# EAGLE design Variable_PWM (EAGLE 9.6.2)
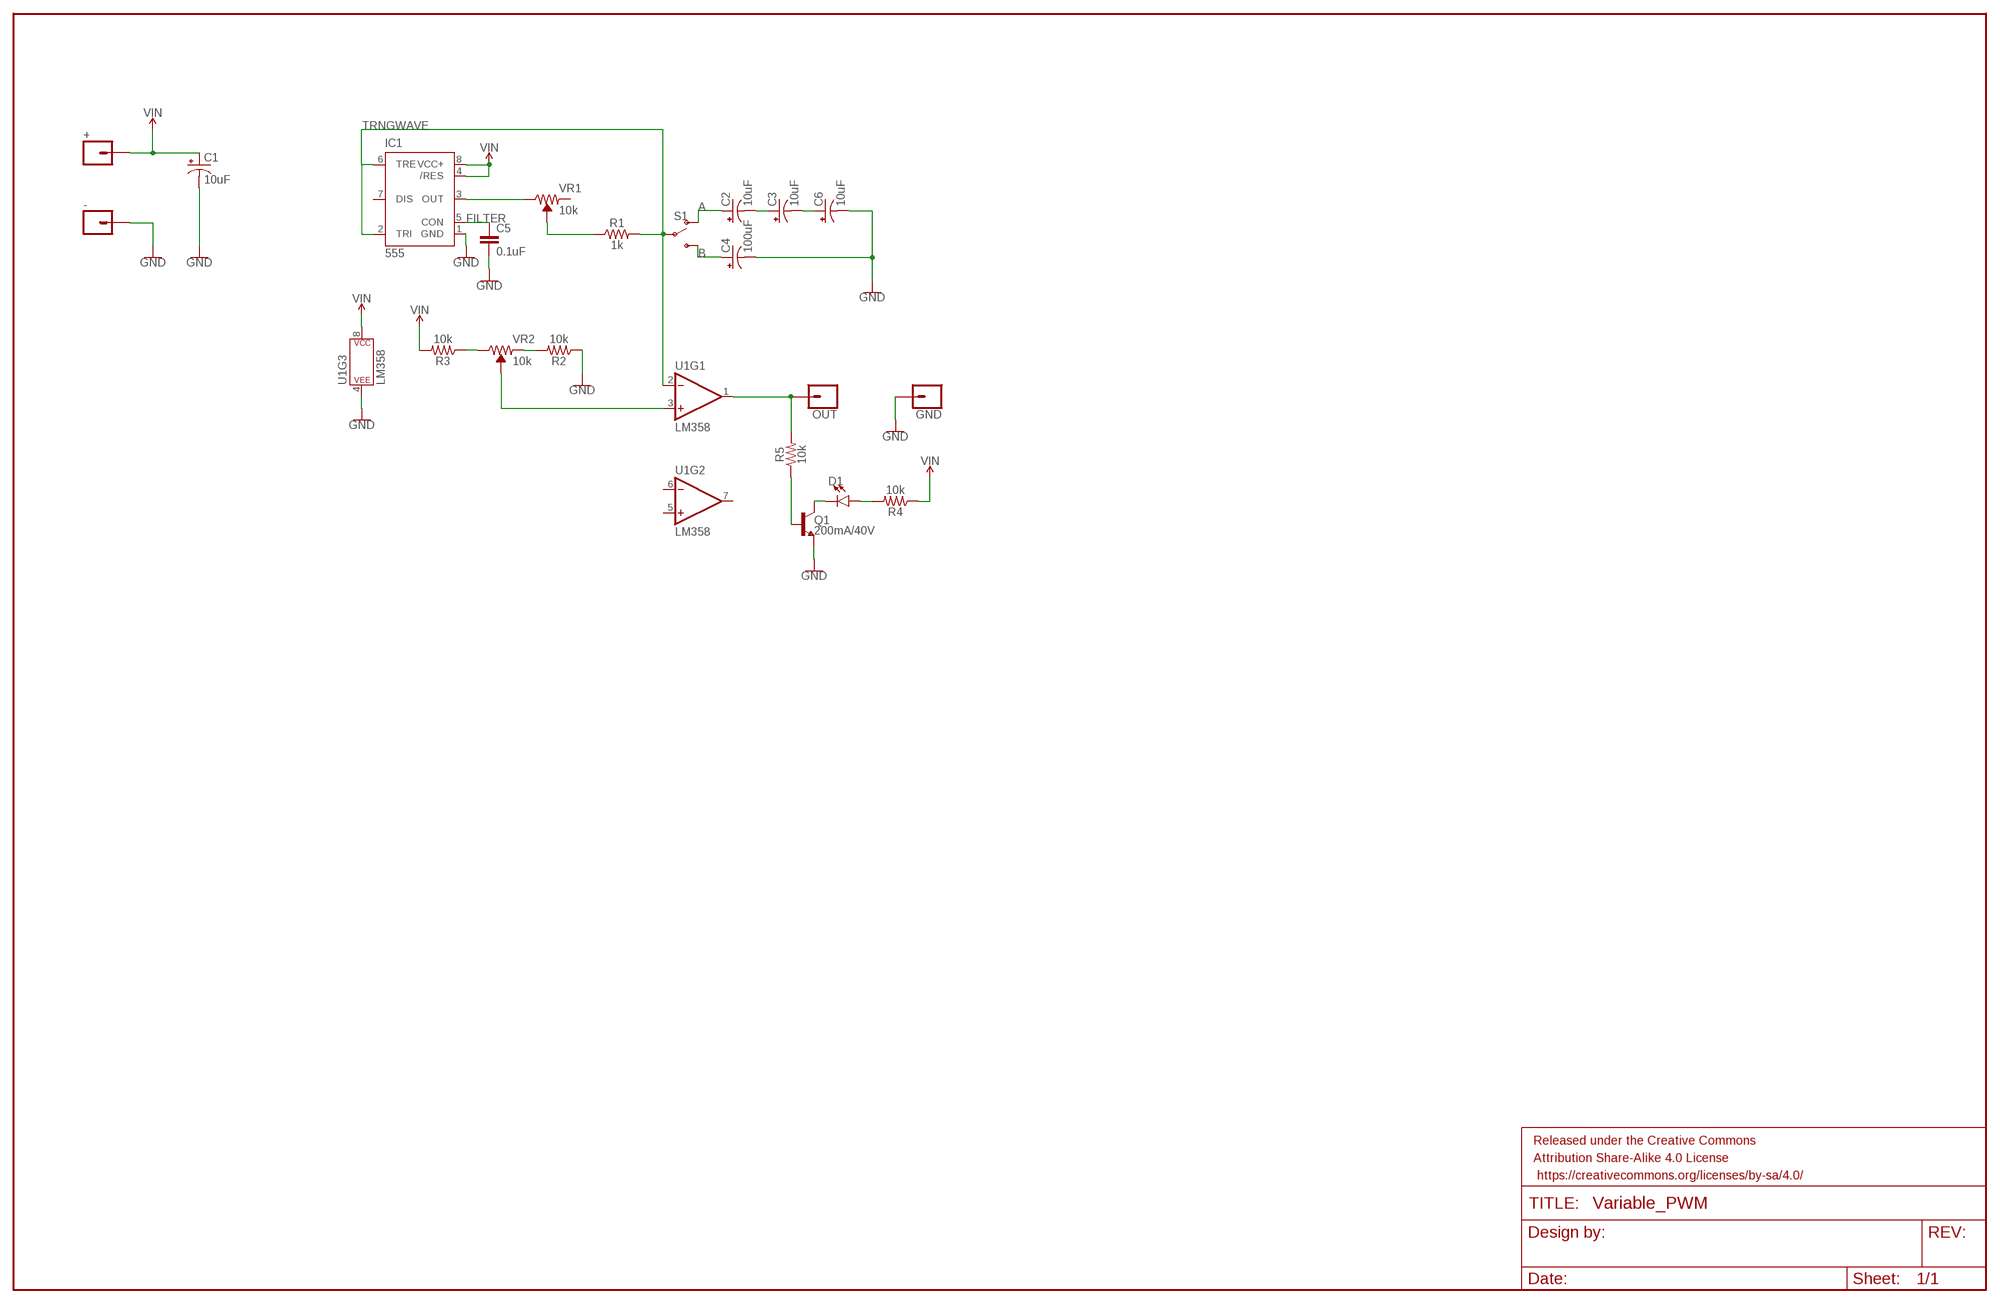
[diagram p0: schematic, sheet 1]

## Parts
+  CONN_01  [1X01]
-  CONN_01  [1X01]
C1  10uF  10UF-POLAR-RADIAL-2.5MM-25V-20%  [CPOL-RADIAL-2.5MM-5MM]
C2  10uF  10UF-POLAR-RADIAL-2.5MM-25V-20%  [CPOL-RADIAL-2.5MM-5MM]
C3  10uF  10UF-POLAR-RADIAL-2.5MM-25V-20%  [CPOL-RADIAL-2.5MM-5MM]
C4  100uF  100UF-POLAR-RADIAL-2.5MM-25V-20%  [CPOL-RADIAL-2.5MM-6.5MM]
C5  0.1uF  0.1UF-KIT-EZ-50V-20%  [CAP-PTH-SMALL-KIT]
C6  10uF  10UF-POLAR-RADIAL-2.5MM-25V-20%  [CPOL-RADIAL-2.5MM-5MM]
D1  LED5MM  [LED_5MM]
FRAME1  FRAME-LEDGERNO_FOOTPRINT  [DUMMY]
GND  CONN_01  [1X01]
IC1  555  555P  [DIP08]
OUT  CONN_01  [1X01]
Q1  200mA/40V  TRANS_NPN-2N3904  [TO-92]
R1  1k  1KOHM-HORIZ-1/4W-1%  [AXIAL-0.3]
R2  10k  10KOHM-HORIZ-1/4W-1%  [AXIAL-0.3]
R3  10k  10KOHM-HORIZ-1/4W-1%  [AXIAL-0.3]
R4  10k  10KOHM-HORIZ-1/4W-1%  [AXIAL-0.3]
R5  10k  10KOHM-HORIZ-1/4W-1%  [AXIAL-0.3]
S1  SWITCH-SPDT-PTH-11.6X4.0MM  [SWITCH_SPDT_PTH_11.6X4.0MM]
U1  LM358  [DIP08]
VR1  10k  TRIMPOT-PTH-10MM-KNOB-1/2W-10%  [TRIMPOT-PTH-3386U]
VR2  10k  TRIMPOT-PTH-10MM-KNOB-1/2W-10%  [TRIMPOT-PTH-3386U]

## Nets
A: C2.1(+) S1.1(O)
B: C4.1(+) S1.3(S)
FILTER: C5.1 IC1.5(CON)
GND: -.1 C1.2(-) C4.2(-) C5.2 C6.2(-) GND.1 IC1.1(GND) Q1.1(E) R2.P$1 U1.4(P$V-)
N$1: C2.2(-) C3.1(+)
N$2: C3.2(-) C6.1(+)
N$3: R1.P$1 VR1.2(WIPER)
N$4: IC1.3(OUT) VR1.3(CW)
N$8: R2.P$2 VR2.1(CCW)
N$9: R3.P$1 VR2.3(CW)
N$10: U1.3(+IN) VR2.2(WIPER)
N$12: D1.A R4.P$2
N$13: D1.K(C) Q1.3(C)
N$14: Q1.2(B) R5.P$1
OUT: OUT.1 R5.P$2 U1.1(OUT)
TRNGWAVE: IC1.2(TRI) IC1.6(TRE) R1.P$2 S1.2(P) U1.2(-IN)
VIN: +.1 C1.1(+) IC1.4(/RES) IC1.8(VCC+) R3.P$2 R4.P$1 U1.8(P$V+)
Unconnected: IC1.7(DIS) U1.5(+IN) U1.6(-IN) U1.7(OUT) VR1.1(CCW)

## Library data of the parts
+ - GND OUT = SparkFun-Connectors:CONN_01: Single connection point. Often used as Generic Header-pin footprint for 0.1 inch spaced/style header connections On any of the 0.1 inch spaced packages, you can populate with these: Break Away Headers - Straight <https://www.sparkfun.com/products/116> (PRT-00116) Break Away Male Headers - Right Angle <https://www.sparkfun.com/products/553> (PRT-00553) Female Headers <https://www.sparkfun.com/products/115> (PRT-00115) Break Away Headers - Machine Pin <https://www.sparkfun.com/products/117> (PRT-00117) Break Away Female Headers - Swiss Machine Pin <https://www.sparkfun.com/products/743> (PRT-00743) This device is also useful as a general connection point to wire up your design to another part of your project. Our various solder wires solder well into these plated through hole pads. Hook-Up Wire - Assortment (Stranded, 22 AWG) <https://www.sparkfun.com/products/11375> (PRT-11375) Hook-Up Wire - Assortment (Solid Core, 22 AWG) <https://www.sparkfun.com/products/11367> (PRT-11367) View the entire wire category on our website here <https://www.sparkfun.com/categories/141> Special notes: SMTSO-256-ET is a "flush mount" nut for a 4-40 screw. We mostly use this on specialty testbeds; it is a nice way to connect hardware to your PCB at an adjustable hieght. Also note, the SNAP packages are for using a snappable style connector. We sell a baggie of snaps and they are also used on two LilyPad designs: Snap Assortment - 30 pack (male and female) <https://www.sparkfun.com/products/11347> (DEV-11347) LilyPad Arduino SimpleSnap <https://www.sparkfun.com/products/10941> (DEV-10941) LilyPad SimpleSnap Protoboard <https://www.sparkfun.com/products/10940> (DEV-10940)
C1-C3 C6 = SparkFun-Capacitors:10UF-POLAR: 10.0µF polarized capacitors A capacitor is a passive two-terminal electrical component used to store electrical energy temporarily in an electric field.; PROD_ID: CAP-08440
C4 = SparkFun-Capacitors:100UF-POLAR: 100µF polarized capacitors A capacitor is a passive two-terminal electrical component used to store electrical energy temporarily in an electric field.; PROD_ID: CAP-08439
C5 = SparkFun-Capacitors:0.1UF: 0.1µF ceramic capacitors A capacitor is a passive two-terminal electrical component used to store electrical energy temporarily in an electric field.; PROD_ID: CAP-08370
D1 = SparkFun-LED:LED: LED (Generic) Standard schematic elements and footprints for 5mm, 3mm, 1206, and 0603 sized LEDs. Generic LEDs with no color specified.
FRAME1 = SparkFun-Aesthetics:FRAME-LEDGER: Schematic Frame - Ledger Standard 11x14 US Ledger frame
IC1 = SparkFun-IC-Special-Function:555: General purpose bipolar Timer Datasheet <http://www.sparkfun.com/datasheets/Components/General/ne555.pdf> SparkFun Products SparkFun SparkPunk Sequencer Kit <https://www.sparkfun.com/products/12707> (KIT-12707) Storefront Component: 555 Timer <https://www.sparkfun.com/products/9273> (COM-09273) Two parts valid for production: VFP: IC-11930 (M7555 PTH) VFP: IC-09173 (555 PTH) - Preferred; PROD_ID: IC-09173; PROD_ID_ALT: IC-09173
Q1 = SparkFun-DiscreteSemi:TRANS_NPN: NPN transistor Current controlled devices typically used to amplify current or used as a switch. BC547 - COM-08928 <http://www.sparkfun.com/products/8928> (TO-92 45V 100mA) (1.Collector 2.Base 3.Emitter) 2N3904 - COM-00521 <http://www.sparkfun.com/products/521> (TO-92 40V 200mA) (1.Emitter 2.Base 3.Collector) P2N2222A - COM-12852 <http://www.sparkfun.com/products/12852> (TO-92 40V 600mA) (1.Collector 2.Base 3.Emitter); PROD_ID: TRANS-08447
R1 = SparkFun-Resistors:1KOHM: 1kΩ resistor A resistor is a passive two-terminal electrical component that implements electrical resistance as a circuit element. Resistors act to reduce current flow, and, at the same time, act to lower voltage levels within circuits. - Wikipedia; PROD_ID: RES-12182
R2-R5 = SparkFun-Resistors:10KOHM: 10kΩ resistor A resistor is a passive two-terminal electrical component that implements electrical resistance as a circuit element. Resistors act to reduce current flow, and, at the same time, act to lower voltage levels within circuits. - Wikipedia; PROD_ID: RES-12183
S1 = SparkFun-Switches:SWITCH-SPDT: Single Pole, Double Throw (SPDT) Switch Single-pole, double-throw (SPDT) switch. Variant Overview SMD-AYZ0202 Surface Mount DPDT Switch <https://www.sparkfun.com/products/597> (COM-00597) Used on e.g. LilyPad Arduino USB - ATmega32U4 Board <https://www.sparkfun.com/products/12049> PTH-11.6X4.0MM SPDT Mini Power Switch <https://www.sparkfun.com/products/102> (COM-00102) Used on e.g. SparkFun Simon Says - Through-Hole Soldering Kit <https://www.sparkfun.com/products/10547> (KIT-10547) PTH-11.6X4.0MM-KIT KIT version of SPDT Mini Power Switch - Simplifies soldering by removing tStop of switch pins - only one side can be soldered. PTH-11.6X4.0MM-LOCK LOCK version of SPDT Mini Power Switch - Offset pins hold switch in place for easier soldering. SMD-RIGHT-ANGLE Surface Mount Right Angle Switch <https://www.sparkfun.com/products/10860> (COM-10860) Used on e.g. SparkFun ESP8266 Thing <https://www.sparkfun.com/products/13231>; PROD_ID: SWCH-08261; SF_SKU: COM-00102
U1 = SparkFun-IC-Amplifiers:LM358: LM358 Jellybean op-amp Datasheet <http://www.sparkfun.com/datasheets/Components/General/LM358.pdf> SparkFun Products Op-Amp (Thru-Hole) - LM358 <https://www.sparkfun.com/products/9456> (COM-09456); PROD_ID: IC-09172
VR1 VR2 = SparkFun-Resistors:TRIMPOT: Trimming Potentiometer (Trimpot) Three-terminal potentiometers, with an adjustable wiper and two adjustable resistors. A pot can be used to create a configurable voltage divider, or as a variable resistor. "Trimpots" are a subset of potentiometers, usually intended for "set-and-forget" applications. They're often more delicate than standard potentiometers - rated for fewer turns. Variants PTH-KNOB - PTH Trimpot w/ finger-adjustable knob Trimpot 10K with Knob <https://www.sparkfun.com/products/9806> (COM-09806) Datasheet <http://www.sparkfun.com/datasheets/Components/General/TSR-3386.pdf> SMD-3MM-CLOSED-FRAME - SMD 3mm Square Closed-Frame Trimpot Used on e.g. EasyDriver - Stepper Motor Driver <https://www.sparkfun.com/products/12779> Datasheet <http://www.bitechnologies.com/pdfs/22.pdf> (22AR10KTR) SMD-5MM - SMD 5mm Square Closed-Frame Trimpot Used on e.g. IOIO-OTG - V2.2 <https://www.sparkfun.com/products/13613> Datasheet <http://www.vishay.com/docs/51008/ts53.pdf> (TS53YL502MR10) SMD-3MM-1/10W-25% - 3mm Square Open-Frame Trimpot Used on e.g. SparkFun Shapeoko <https://www.sparkfun.com/products/13899> Datasheet <http://www.bourns.com/docs/Product-Datasheets/TC33.pdf> (TC33X-2-103E); PROD_ID: RES-09730; SF_SKU: COM-09806

## Board
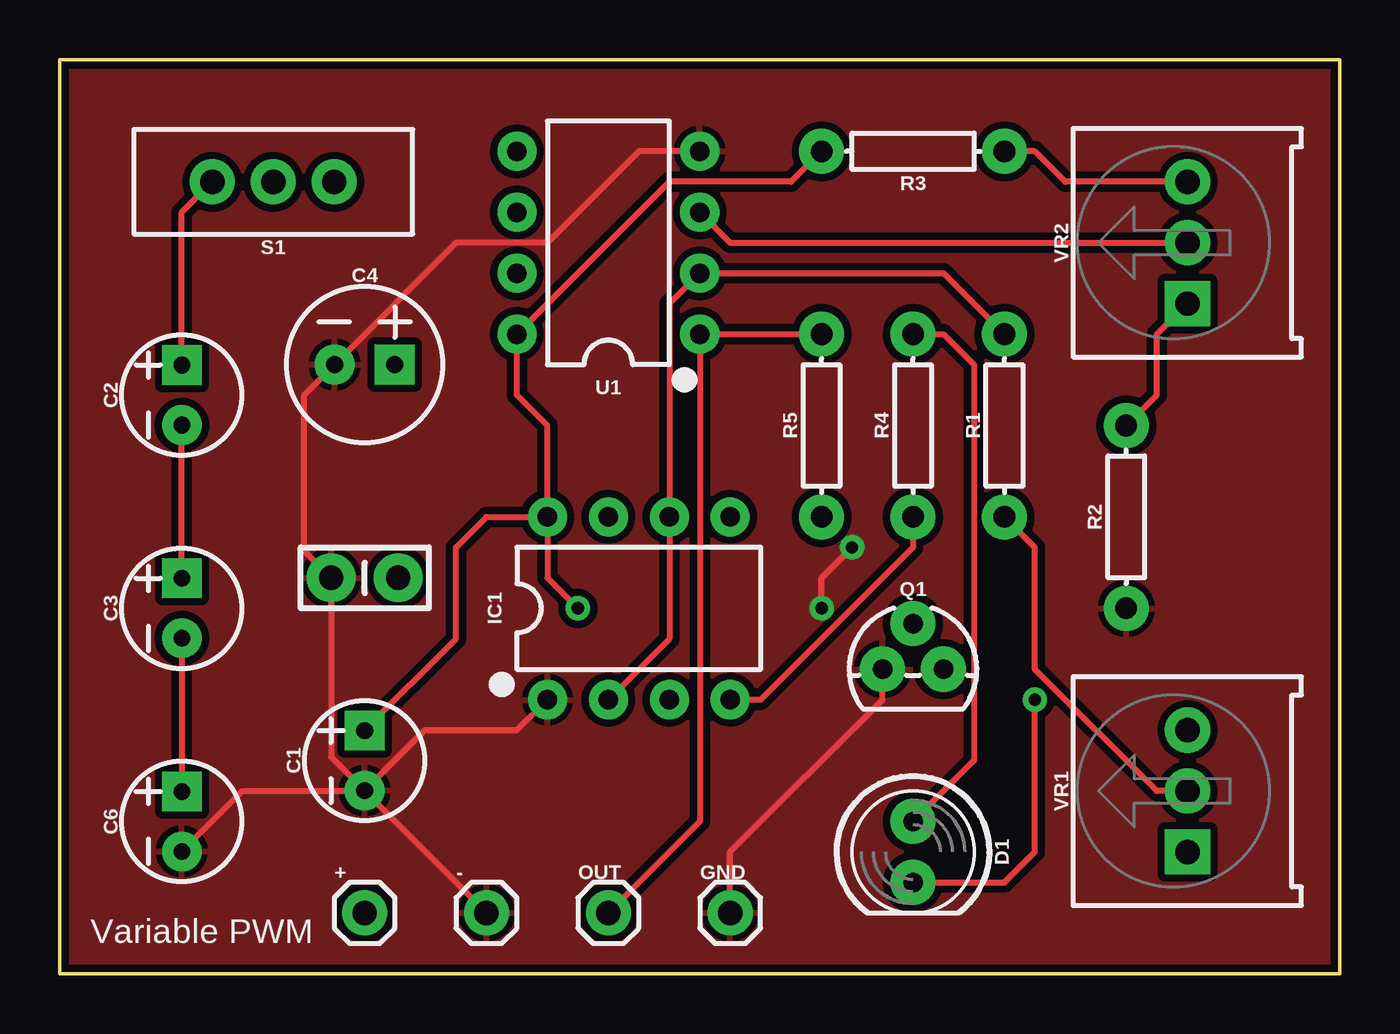
[diagram p1: board, top side]
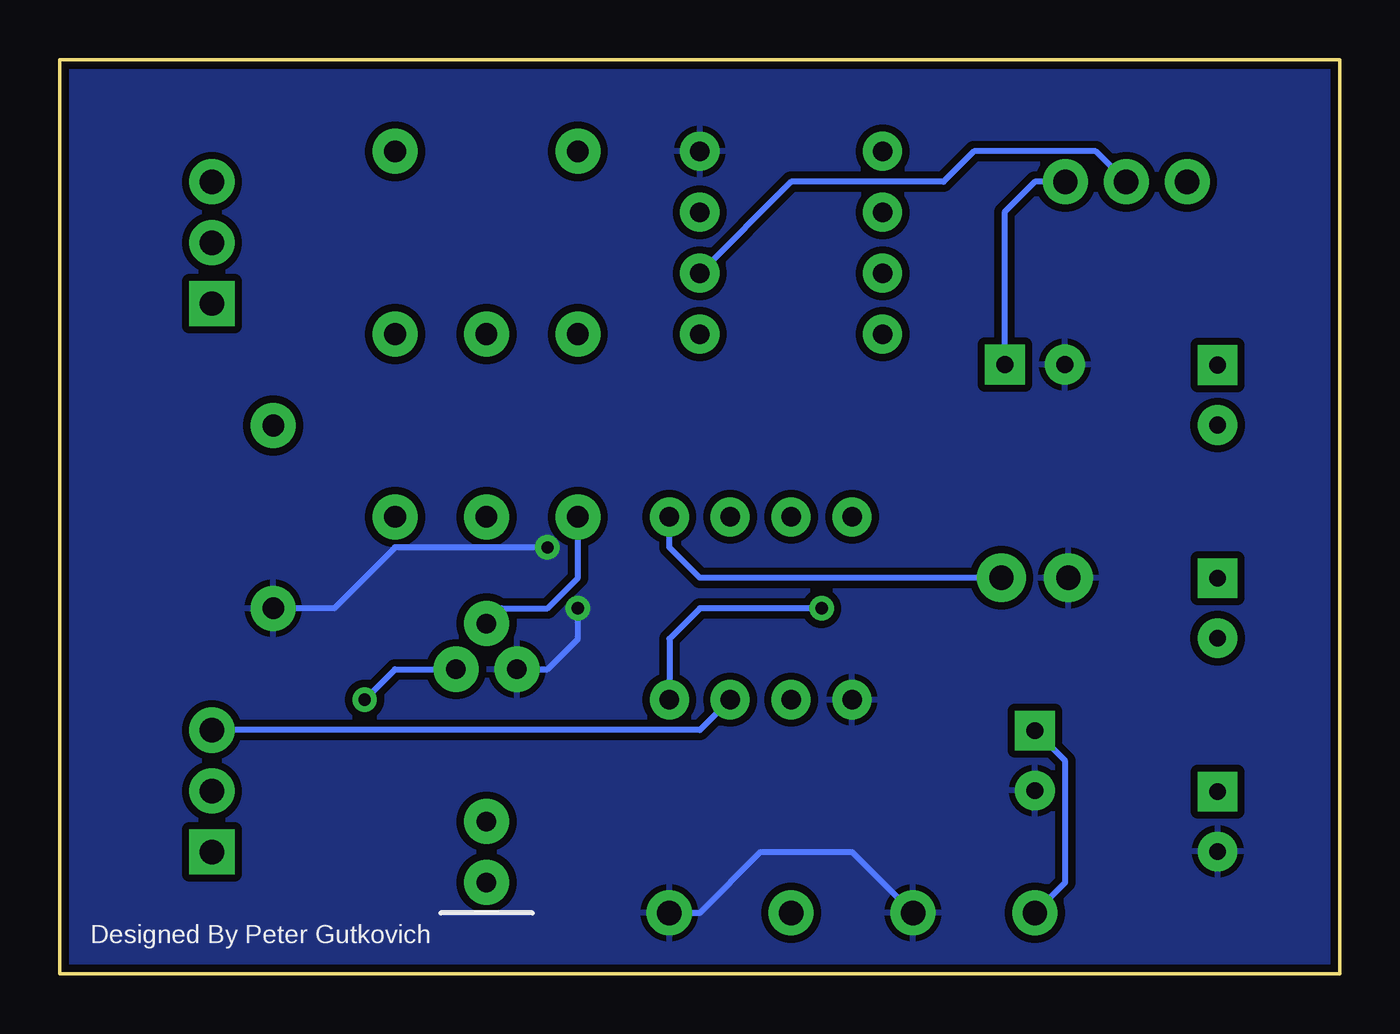
[diagram p2: board, bottom side, seen from below]

Size 53.34 x 38.1 mm. Coordinates in mm from the lower left corner, seen from the top.
Outline: 0,0 53.34,0 53.34,38.1 0,38.1 0,0
Copper layers (1*16): Top 0.035mm / dielectric 1.5mm / Bottom 0.035mm
Design rules "SparkFun": minimum track width 8mil, minimum drill 20mil, track to track 8mil, track to pad 8mil, pad to pad 8mil, via to via 8mil, smd to smd 8mil, copper to edge 8mil, drill to drill 8mil, minimum pad ring 12mil, minimum via ring 10mil, stop-mask expansion 4mil, vias tented up to drill 20mil, thermal gap 10mil

### Footprints (pad centres in the part's own frame; a part is rotated, then mirrored left to right if it is on the bottom)
1X01 = drill 1.016 pad 1.88: 1 0,0
CPOL-RADIAL-2.5MM-5MM = drill 0.7 pad 1.651 square: 1 1.25,0 | drill 0.7 pad 1.651: 2 -1.25,0
CPOL-RADIAL-2.5MM-6.5MM = drill 0.7 pad 1.651 square: 1 1.25,0 | drill 0.7 pad 1.651: 2 -1.25,0
CAP-PTH-SMALL-KIT = drill 1.016 pad 2.032: 1 -1.397,0; 2 1.397,0
LED_5MM = drill 0.813 pad 1.88: A -1.27,0; K 1.27,0
DIP08 = drill 0.813 pad 1.626: 1 -3.81,-3.81; 2 -1.27,-3.81; 3 1.27,-3.81; 4 3.81,-3.81; 5 3.81,3.81; 6 1.27,3.81; 7 -1.27,3.81; 8 -3.81,3.81
TO-92 = drill 0.813 pad 1.88: 1 -1.27,0; 2 0,1.905; 3 1.27,0
AXIAL-0.3 = drill 0.9 pad 1.88: P$1 -3.81,0; P$2 3.81,0
SWITCH_SPDT_PTH_11.6X4.0MM = drill 1.016 pad 1.88: 1 0,2.54; 2 0,0; 3 0,-2.54
TRIMPOT-PTH-3386U = drill 1.016 pad 1.88 square: 1 -2.54,-0.015 | drill 1.016 pad 1.88: 2 0,-0.015; 3 2.54,-0.015

### Placement (x,y rotation side)
+  12.7,2.54 0 top
-  17.78,2.54 0 top
C1  12.7,8.89 90 top
C2  5.08,24.13 90 top
C3  5.08,15.24 90 top
C4  12.7,25.4 0 top
C5  12.7,16.51 180 top
C6  5.08,6.35 90 top
D1  35.56,5.08 270 top
FRAME1  -31.75,44.45 0 top  (outside the outline)
GND  27.94,2.54 0 top
IC1  24.13,15.24 0 top
OUT  22.86,2.54 0 top
Q1  35.56,12.7 0 top
R1  39.37,22.86 90 top
R2  44.45,19.05 90 top
R3  35.56,34.29 180 top
R4  35.56,22.86 90 top
R5  31.75,22.86 90 top
S1  8.89,33.02 90 top
U1  22.86,30.48 90 top
VR1  46.99,7.62 90 top
VR2  46.99,30.48 90 top

### Tracks (layer width: path | path; a pad name or v marks a point on that pad's centre or on a via)
A
  Top 0.254: C2.1 5.08,31.75 S1.1
B
  Bottom 0.254: S1.3 12.7,33.02 13.97,31.75 13.97,25.42 C4.1
FILTER
  Bottom 0.254: C5.1 26.67,16.51 27.94,17.78 IC1.5
GND  (via drill 0.51)
  Top 0.254: C4.2 | C4.2 10.16,24.11 10.16,17.65 C5.2 11.3,9.04 C1.2 | 12.7,7.62 C1.2 | C1.2 15.22,10.16 19.05,10.16 IC1.1 | C6.2 7.6,7.62 12.7,7.62 | U1.4 24.13,34.29 20.32,30.48 16.51,30.48 C4.2 | GND.1 27.94,5.08 34.29,11.43 Q1.1 | v33.02,17.78 31.75,16.51 v31.75,15.24 | -.1 12.7,7.62
  Bottom 0.254: Q1.1 33.02,12.7 31.75,13.97 v31.75,15.24 | v33.02,17.78 39.37,17.78 41.91,15.24 R2.P$1 | GND.1 26.67,2.54 24.13,5.08 20.32,5.08 -.1
  pour Top (isolate 0.305): 0,0 53.34,0 53.34,38.1 0,38.1
  pour Bottom (isolate 0.305): 0,0 0,38.1 53.34,38.1 53.34,0
N$1
  Top 0.254: C3.1 C2.2
N$2
  Top 0.254: C3.2 C6.1
N$3
  Top 0.254: VR1.2 45.72,7.62 40.64,12.7 40.64,17.78 R1.P$1
N$4
  Bottom 0.254: IC1.3 26.67,10.16 VR1.3
N$8
  Top 0.254: R2.P$2 45.72,24.13 45.72,26.67 46.99,27.94 VR2.1
N$9
  Top 0.254: VR2.3 41.91,33.02 40.64,34.29 R3.P$1
N$10
  Top 0.254: U1.3 27.94,30.48 VR2.2
N$12
  Top 0.254: R4.P$2 36.83,26.67 38.1,25.4 38.1,8.89 D1.A
N$13  (via drill 0.51)
  Top 0.254: D1.K 39.37,3.81 40.64,5.08 v40.64,11.43
  Bottom 0.254: v40.64,11.43 39.37,12.7 Q1.3
N$14
  Bottom 0.254: Q1.2 34.92,15.24 33.02,15.24 31.75,16.51 R5.P$1
OUT
  Top 0.254: R5.P$2 U1.1 26.67,6.35 OUT.1
TRNGWAVE
  Top 0.254: R1.P$2 36.83,29.21 U1.2 25.4,27.94 IC1.6 25.4,13.97 IC1.2
  Bottom 0.254: S1.2 10.16,34.29 15.24,34.29 16.51,33.02 22.86,33.02 U1.2
VIN  (via drill 0.51)
  Top 0.254: C1.1 12.7,10.16 16.51,13.97 16.51,17.78 17.78,19.05 IC1.8 | IC1.8 20.32,22.86 19.05,24.13 U1.8 25.4,33.02 30.48,33.02 R3.P$2 | IC1.8 20.32,16.51 v21.59,15.24 | R4.P$1 35.56,17.78 29.21,11.43 IC1.4
  Bottom 0.254: +.1 11.43,3.81 11.43,8.87 C1.1 | v21.59,15.24 26.67,15.24 27.94,13.97 IC1.4

### Text on the board
tPlace: Variable PWM
bPlace: Designed By Peter Gutkovich